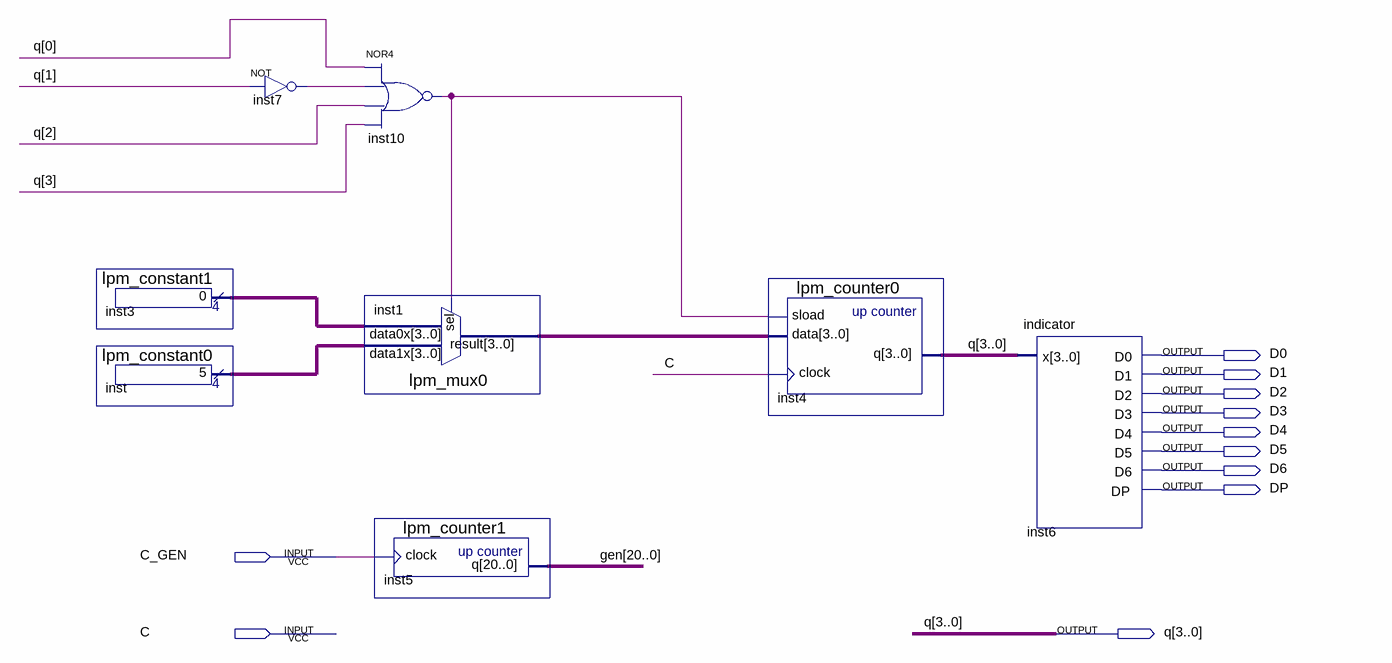
[diagram p0: schematic sheet]
// Quartus schematic Lab7_1_2.bdf as structural Verilog: 8 symbols, 11 pins
module Lab7_1_2 (
  input  C_GEN,
  input  C,
  output D0,
  output D1,
  output D2,
  output D3,
  output D4,
  output D5,
  output D6,
  output DP,
  output [3:0] q
);

  wire inst7_out, inst10_out;
  wire [3:0] inst1_result, inst3_result, inst_result;
  wire [20:0] gen;

  lpm_constant1 inst3 (.result(inst3_result));
  lpm_constant0 inst (.result(inst_result));
  not inst7 (inst7_out, q[1]);
  nor inst10 (inst10_out, q[0], inst7_out, q[2], q[3]);
  lpm_mux0 inst1 (.data1x(inst_result), .data0x(inst3_result), .sel(inst10_out), .result(inst1_result));
  lpm_counter1 inst5 (.clock(C_GEN), .q(gen));
  lpm_counter0 inst4 (.sload(inst10_out), .data(inst1_result), .clock(C), .q(q));
  indicator inst6 (.x(q), .D0(D0), .D1(D1), .D2(D2), .D3(D3), .D4(D4), .D5(D5), .D6(D6), .DP(DP));
endmodule
